# EAGLE board 2018-SPIT-IH-Ver4-Atmeha-final1 (EAGLE 6.1), part 1 of 3
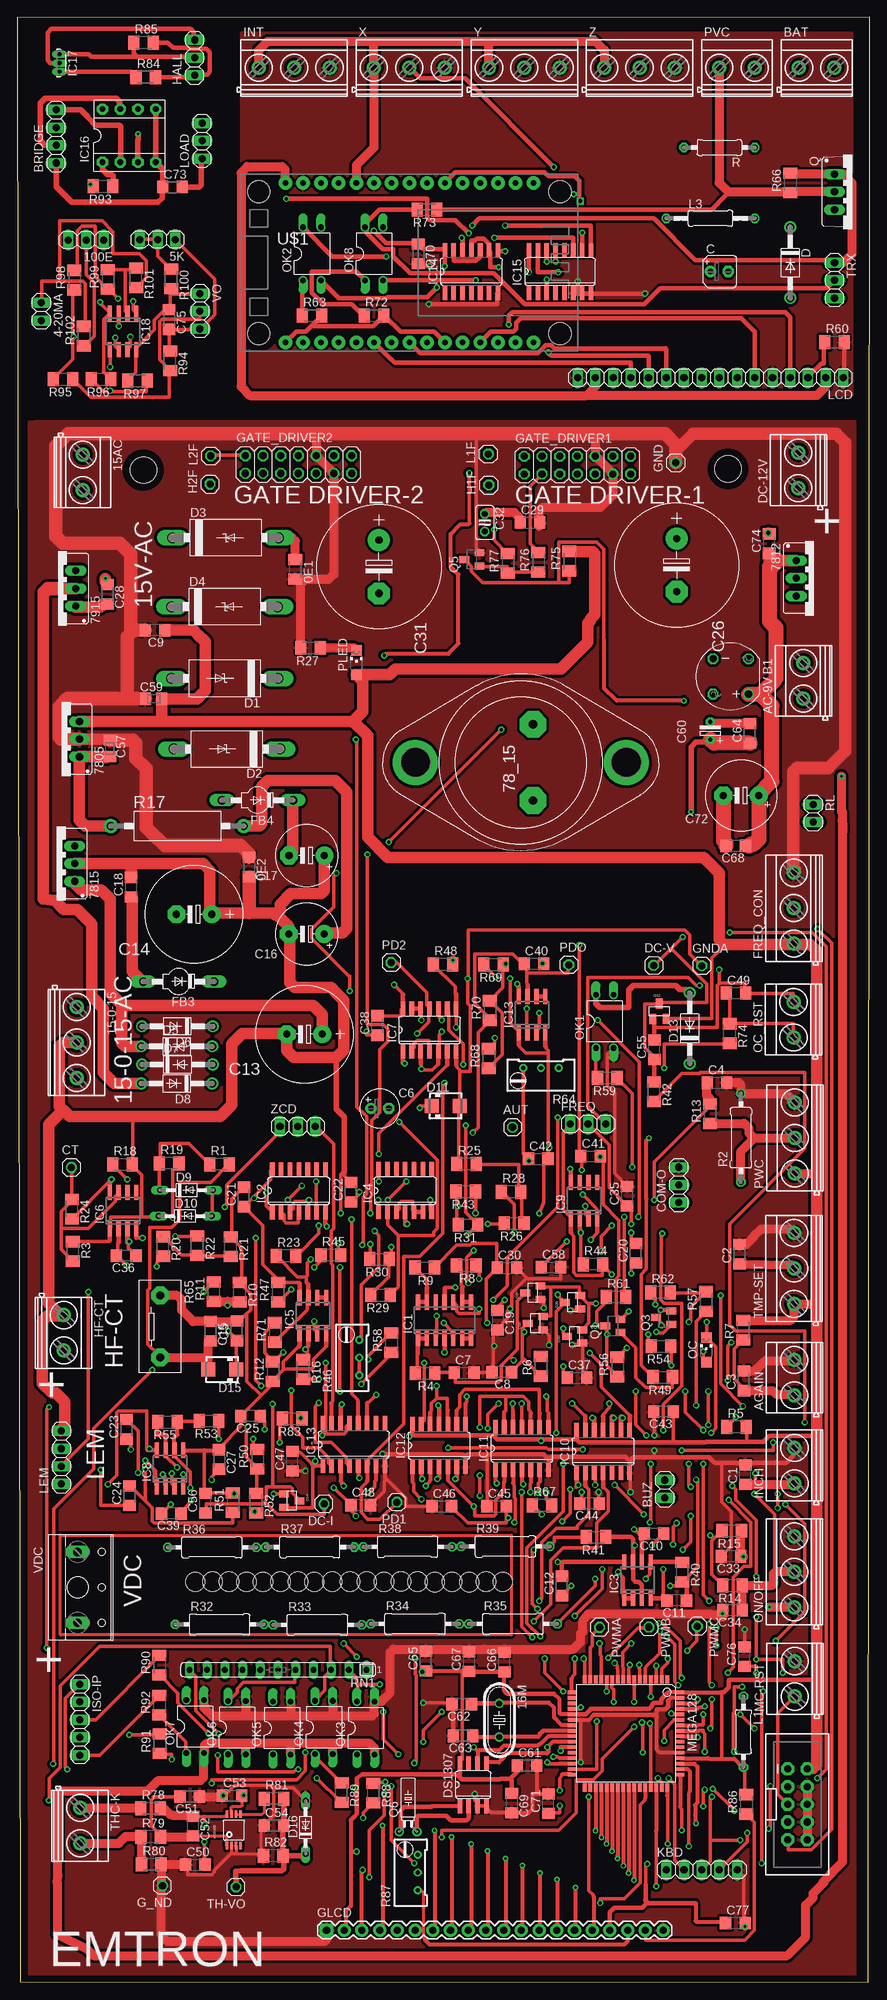
[diagram p4: board, top side]
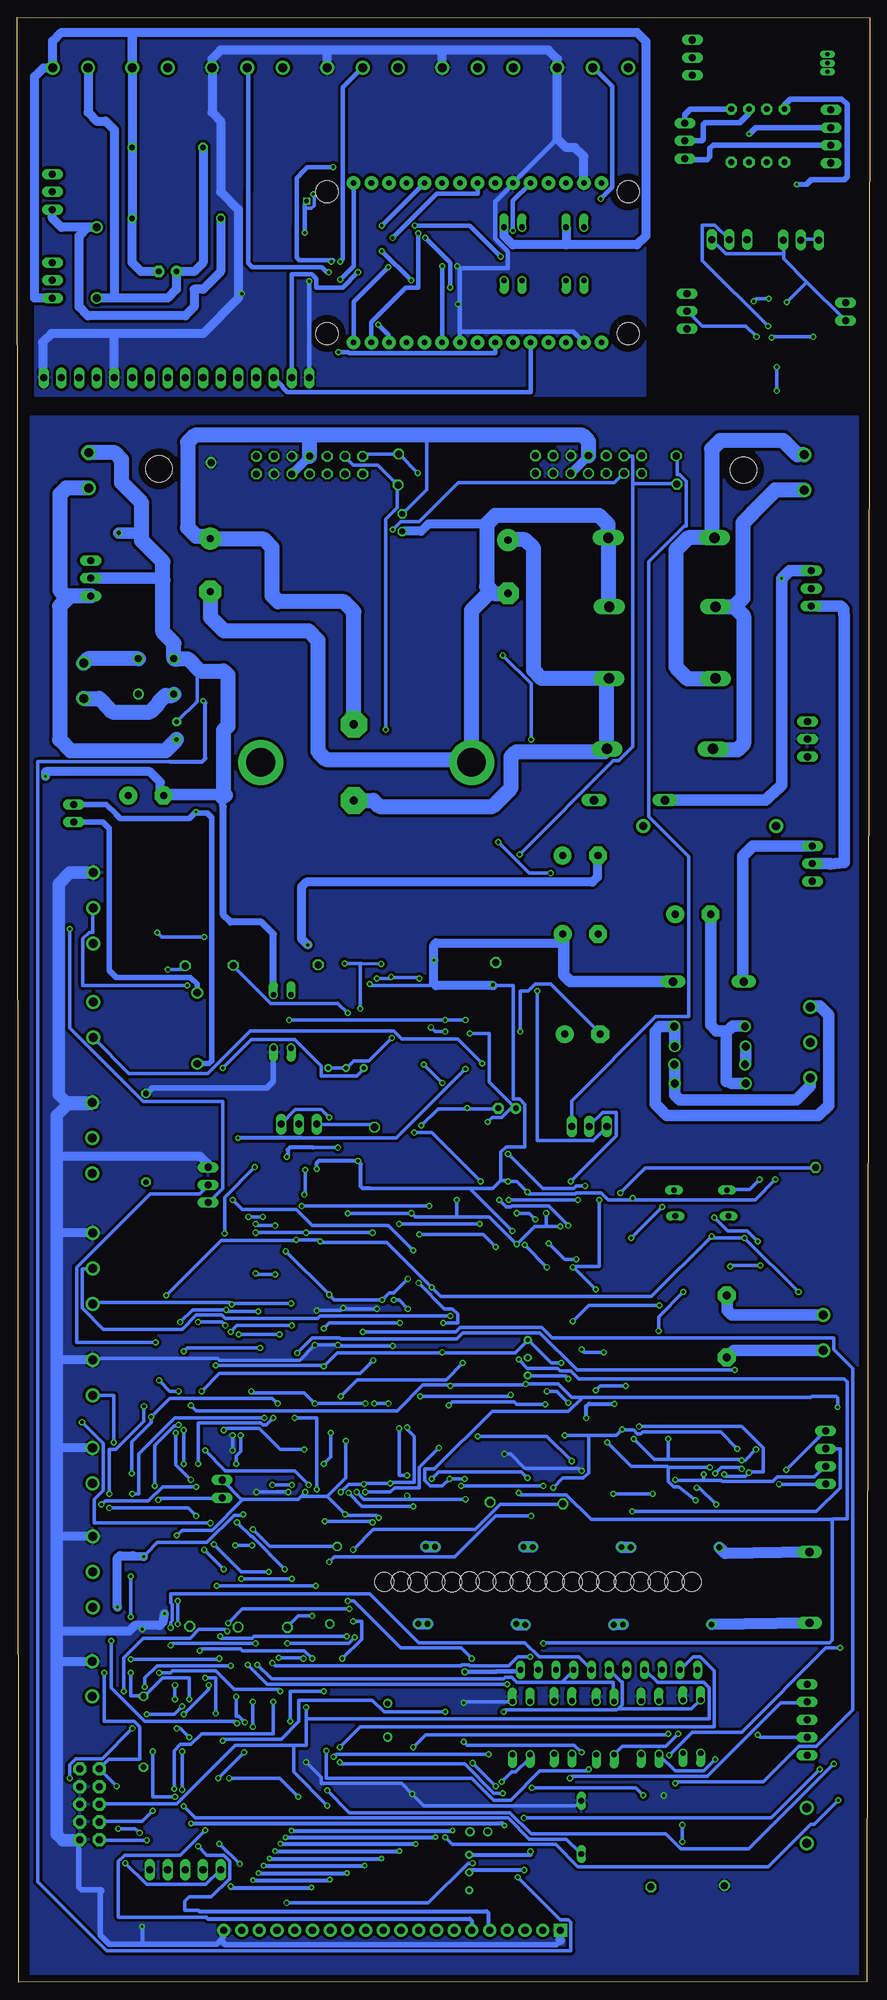
[diagram p5: board, bottom side, seen from below]

Size 122.19 x 281.79 mm. Coordinates in mm from the lower left corner, seen from the top.
Outline: 0.42,0.05 121.98,0 122.19,281.79 0,281.76 0.42,0.05
Copper layers (1*16): Top 0.035mm / dielectric 1.5mm / Bottom 0.035mm
Design rules: minimum track width 20mil, minimum drill 18mil, track to track 8mil, track to pad 8mil, pad to pad 8mil, via to via 8mil, smd to smd 8mil, copper to edge 40mil, drill to drill 8mil, minimum pad ring 10mil, minimum via ring 8mil, stop-mask expansion 4mil, vias tented up to drill 0mil, thermal gap 10mil
Holes 2.8 mm at 25.5,57.4 27.96,57.44 30.34,57.42 32.82,57.4 35.22,57.4 37.74,57.43 40.24,57.45 42.57,57.4 45.14,57.46 47.68,57.45 50.1,57.44 52.55,57.4 54.98,57.47 57.35,57.46 59.85,57.37 62.32,57.4 64.8,57.37 67.18,57.42 69.59,57.4
Holes 3.81 mm at 101.89,217.04 18.05,216.86

## Footprints (pad centres in the part's own frame; a part is rotated, then mirrored left to right if it is on the bottom)
M1206 = smd 1.6 x 2: 1 -1.4,0; 2 1.4,0
C1206 = smd 1.6 x 1.8: 1 -1.4,0; 2 1.4,0
1X02 = drill 1.016 long: 1 -1.27,0; 2 1.27,0
1X03 = drill 1.016 long: 1 -2.54,0; 2 0,0; 3 2.54,0
MKDSN1,5/3-5,08 = drill 1.3 pad 2: 1 -7.641,0.025; 2 -2.561,0.025; 3 2.519,0.025
MKDSN1,5/2-5,08 = drill 1.3 pad 2: 1 -2.561,0.025; 2 2.519,0.025
HC49/S = drill 0.813: 1 -2.413,0; 2 2.413,0
TO3-78 = drill 1.194 pad 3.81 octagon: 1 -1.778,-5.461; 2 -1.778,5.461 | drill 4.115 pad 6.477: 3 15.113,0; 3@ -15.113,0
78XXS = drill 1.016 long: GND 0,-2.54; IN -2.54,-2.54; OUT 2.54,-2.54
79XXS = drill 1.016 long: GND -2.54,-2.54; IN 0,-2.54; OUT 2.54,-2.54
MSOP8 = smd 0.4 x 1.1: 1 -0.975,-2.25; 2 -0.325,-2.25; 3 0.325,-2.25; 4 0.975,-2.25; 5 0.975,2.25; 6 0.325,2.25; 7 -0.325,2.25; 8 -0.975,2.25
1X01 = drill 1.016 octagon: 1 0,0
RB1A = drill 1.016: + -2.54,2.54 | drill 1.016 octagon: - 2.54,-2.54; AC1 2.54,2.54; AC2 -2.54,-2.54
1X04 = drill 1.016 long: 1 -3.81,0; 2 -1.27,0; 3 1.27,0; 4 3.81,0
B45181A = drill 0.813 pad 1.6: + -1.27,0 | drill 0.813 pad 1.6 octagon: - 1.27,0
E2,5-6 = drill 0.813 pad 1.6: + -1.27,0 | drill 0.813 pad 1.6 octagon: - 1.27,0
E5-13 = drill 1.016 pad 2.54: + -2.54,0 | drill 1.016 pad 2.54 octagon: - 2.54,0
E5-8,5 = drill 1.016 pad 2.54: + -2.54,0 | drill 1.016 pad 2.54 octagon: - 2.54,0
E7,5-18 = drill 1.016 pad 3.15: + -3.81,0 | drill 1.016 pad 3.15 octagon: - 3.81,0
C025-025X050 = drill 0.813 octagon: 1 -1.27,0; 2 1.27,0
R/2012-12R = smd 1.55 x 1.8: + 1.175,0; - -1.175,0
ES-2,5 = drill 0.61 pad 1.27 octagon: 1 -1.27,0; 2 1.27,0
E5-10,5 = drill 1.016 pad 2.54: + -2.54,0 | drill 1.016 pad 2.54 octagon: - 2.54,0
DO41-10 = drill 1.118: A 5.08,0; C -5.08,0
C4111-15 = drill 1.499 long: A 7.62,0; C -7.62,0
DO34Z7 = drill 0.813 long: A 3.81,0; C -3.81,0
SMA = smd 2 x 2: A 2,0; C -2,0
SOT23 = smd 1 x 1.4: 1 -0.95,-1.1; 2 0.95,-1.1; 3 0,1.1
SOIC-8 = smd 2.032 x 0.66: 1 -3.073,1.27; 2 -3.073,0; 3 -3.073,-1.27; 4 -3.073,-2.54; 5 3.073,-2.54; 6 3.073,-1.27; 7 3.073,0; 8 3.073,1.27
SOD57-10 = drill 1.194 long: A 5.08,0; C -5.08,0
2X07 = drill 1.016 octagon: 1 -7.62,-1.27; 2 -7.62,1.27; 3 -5.08,-1.27; 4 -5.08,1.27; 5 -2.54,-1.27; 6 -2.54,1.27; 7 0,-1.27; 8 0,1.27; 9 2.54,-1.27; 10 2.54,1.27; 11 5.08,-1.27; 12 5.08,1.27; 13 7.62,-1.27; 14 7.62,1.27
1X20 = drill 1.016 pad 1.88 square: 1 0,0 | drill 1.016 pad 1.88: 2 2.54,0; 3 5.08,0; 4 7.62,0; 5 10.16,0; 6 12.7,0; 7 15.24,0; 8 17.78,0; 9 20.32,0; 10 22.86,0; 11 25.4,0; 12 27.94,0; 13 30.48,0; 14 33.02,0; 15 35.56,0; 16 38.1,0; 17 40.64,0; 18 43.18,0; 19 45.72,0; 20 48.26,0
SO14 = smd 0.6 x 2.2: 1 -3.81,-2.6; 2 -2.54,-2.6; 3 -1.27,-2.6; 4 0,-2.6; 5 1.27,-2.6; 6 2.54,-2.6; 7 3.81,-2.6; 8 3.81,2.6; 9 2.54,2.6; 10 1.27,2.6; 11 0,2.6; 12 -1.27,2.6; 13 -2.54,2.6; 14 -3.81,2.6
SO14' = smd 0.66 x 2.032: 1 -3.81,-3.073; 2 -2.54,-3.073; 3 -1.27,-3.073; 4 0,-3.073; 5 1.27,-3.073; 6 2.54,-3.073; 7 3.81,-3.073; 8 3.81,3.073; 9 2.54,3.073; 10 1.27,3.073; 11 0,3.073; 12 -1.27,3.073; 13 -2.54,3.073; 14 -3.81,3.073
SO08 = smd 0.6 x 2.2: 1 -1.905,-2.6; 2 -0.635,-2.6; 3 0.635,-2.6; 4 1.905,-2.6; 5 1.905,2.6; 6 0.635,2.6; 7 -0.635,2.6; 8 -1.905,2.6
SO16 = smd 0.66 x 2.032: 1 -4.445,-3.073; 2 -3.175,-3.073; 3 -1.905,-3.073; 4 -0.635,-3.073; 5 0.635,-3.073; 6 1.905,-3.073; 7 3.175,-3.073; 8 4.445,-3.073; 9 4.445,3.073; 10 3.175,3.073; 11 1.905,3.073; 12 0.635,3.073; 13 -0.635,3.073; 14 -1.905,3.073; 15 -3.175,3.073; 16 -4.445,3.073
DIL08 = drill 0.813 pad 1.6 octagon: 1 -3.81,-3.81; 2 -1.27,-3.81; 3 1.27,-3.81; 4 3.81,-3.81; 5 3.81,3.81; 6 1.27,3.81; 7 -1.27,3.81; 8 -3.81,3.81
SIP3-UA = drill 0.6 pad 0.7 long: 1 -1.27,0; 2 0,0; 3 1.27,0
1X05 = drill 1.016 long: 1 -5.08,0; 2 -2.54,0; 3 0,0; 4 2.54,0; 5 5.08,0
2X5-SHROUDED_LOCK = drill 1.016 pad 1.88 octagon: 1 -1.397,5.08; 2 1.397,5.08; 3 -1.397,2.54; 4 1.397,2.54; 5 -1.397,0; 6 1.397,0; 7 -1.397,-2.54; 8 1.397,-2.54; 9 -1.397,-5.08; 10 1.397,-5.08
0207/10 = drill 0.813 octagon: 1 -5.08,0; 2 5.08,0
0207/12 = drill 0.813 octagon: 1 -6.35,0; 2 6.35,0
1X16 = drill 1.016 long: 1 -19.05,0; 2 -16.51,0; 3 -13.97,0; 4 -11.43,0; 5 -8.89,0; 6 -6.35,0; 7 -3.81,0; 8 -1.27,0; 9 1.27,0; 10 3.81,0; 11 6.35,0; 12 8.89,0; 13 11.43,0; 14 13.97,0; 15 16.51,0; 16 19.05,0
TQFP64 = smd 1.194 x 0.559: 1 -7.76,5.905; 2 -7.76,5.118; 3 -7.76,4.331; 4 -7.76,3.543; 5 -7.76,2.756; 6 -7.76,1.968; 7 -7.76,1.181; 8 -7.76,0.394; 9 -7.76,-0.394; 10 -7.76,-1.181; 11 -7.76,-1.968; 12 -7.76,-2.756; 13 -7.76,-3.543; 14 -7.76,-4.331; 15 -7.76,-5.118; 16 -7.76,-5.905; 33 7.76,-5.905; 34 7.76,-5.118; 35 7.76,-4.331; 36 7.76,-3.543; 37 7.76,-2.756; 38 7.76,-1.968; 39 7.76,-1.181; 40 7.76,-0.394; 41 7.76,0.394; 42 7.76,1.181; 43 7.76,1.968; 44 7.76,2.756; 45 7.76,3.543; 46 7.76,4.331; 47 7.76,5.118; 48 7.76,5.905 | smd 0.559 x 1.194: 17 -5.905,-7.76; 18 -5.118,-7.76; 19 -4.331,-7.76; 20 -3.543,-7.76; 21 -2.756,-7.76; 22 -1.968,-7.76; 23 -1.181,-7.76; 24 -0.394,-7.76; 25 0.394,-7.76; 26 1.181,-7.76; 27 1.968,-7.76; 28 2.756,-7.76; 29 3.543,-7.76; 30 4.331,-7.76; 31 5.118,-7.76; 32 5.905,-7.76; 49 5.905,7.76; 50 5.118,7.76; 51 4.331,7.76; 52 3.543,7.76; 53 2.756,7.76; 54 1.968,7.76; 55 1.181,7.76; 56 0.394,7.76; 57 -0.394,7.76; 58 -1.181,7.76; 59 -1.968,7.76; 60 -2.756,7.76; 61 -3.543,7.76; 62 -4.331,7.76; 63 -5.118,7.76; 64 -5.905,7.76
CHIPLED_1206 = smd 1.5 x 1.5: A 0,-1.75; C 0,1.75
DIL04 = drill 0.813 offset: 1 -1.27,-3.81; 2 1.27,-3.81; 3 1.27,3.81; 4 -1.27,3.81
TO220BV = drill 1.016 long: D 0,-2.54; G -2.54,-2.54; S 2.54,-2.54
SOT23-BEC = smd 1 x 1.4: B -0.95,-1.1; C 0,1.1; E 0.95,-1.1
TC26H = drill 0.813: 1 -1.27,0; 2 1.27,0
0309/12 = drill 0.813 octagon: 1 -6.35,0; 2 6.35,0
CA5050 = drill 1.2 pad 2: 1 -9.525,0; 2 9.525,0
RTRIM64W = drill 0.61: 1 1.27,-2.54; 2 1.27,0; 3 1.27,2.54
MPC71-5 = drill 1.118 pad 2.54 octagon: 1 -4.445,0; 2 4.445,0
SIL11 = drill 0.813 long: 1 -12.7,0; 2 -10.16,0; 3 -7.62,0; 4 -5.08,0; 5 -2.54,0; 6 0,0; 7 2.54,0; 8 5.08,0; 9 7.62,0; 10 10.16,0; 11 12.7,0
ESP12E_DEVKIT = drill 0.8 pad 1.93: 3V3@0 -11.43,-7.62; 3V3@1 11.43,5.08; 3V3@2 11.43,-17.78; AD0 -11.43,17.78; CLK -11.43,-2.54; CMD -11.43,2.54; D0 11.43,17.78; D1 11.43,15.24; D2 11.43,12.7; D3 11.43,10.16; D4 11.43,7.62; D5 11.43,0; D6 11.43,-2.54; D7 11.43,-5.08; D8 11.43,-7.62; EN -11.43,-10.16; GND@0 -11.43,-5.08; GND@1 -11.43,-15.24; GND@2 11.43,2.54; GND@3 11.43,-15.24; RST -11.43,-12.7; RSV@0 -11.43,15.24; RSV@1 -11.43,12.7; RX 11.43,-10.16; SD0 -11.43,0; SD1 -11.43,5.08; SD2 -11.43,7.62; SD3 -11.43,10.16; TX 11.43,-12.7; VIN -11.43,-17.78 | hole 3.2: -10.16,21.59; 10.16,21.59; 10.16,-21.59; -10.16,-21.59
W237-2N = drill 1.194 long: 1 -5.08,-0.635; 2 5.08,-0.635

## Placement (x,y rotation side)
0E1  0E  [M1206]  39.86,202.62 270 top
0E2  [C1206]  33.23,159.93 270 top
4-20MA  [1X02]  3.43,239.59 270 top
5K  5k  [1X03]  20.11,249.93 180 top
15-0-15  15-0-15  [MKDSN1,5/3-5,08]  8.49,132.19 270 top
15AC  [MKDSN1,5/2-5,08]  9.34,216.51 270 top
16M  16MHz  [HC49/S]  69.1,37.55 270 top
78_15  [TO3-78]  72.17,174.93 180 top
100E  [1X03]  9.84,249.86 180 top
7805  [78XXS]  6.36,178.28 90 top
7812  [78XXS]  114.21,201.35 270 top
7815  [78XXS]  5.65,160.43 90 top
7915  [79XXS]  5.82,199.89 90 top
AC-9V  [MKDSN1,5/2-5,08]  112.7,186.66 90 top
AD8495  AD849X  [MSOP8]  31.02,21.83 0 top
AGAIN  [MKDSN1,5/2-5,08]  111.43,86.72 90 top
AUT  [1X01]  70.99,122.62 0 top
B1  [RB1A]  102.3,187.27 180 top
BAT  [MKDSN1,5/2-5,08]  114.63,274.56 0 top
BRIDGE  [1X04]  5.55,264.73 90 top
BUZ  [1X02]  92.83,70.73 90 top
C  47uf  [B45181A]  100.66,245.35 0 top
C1  1u  [C1206]  104.4,72.8 90 top
C2  0.1  [C1206]  103.55,104.38 90 top
C3  1u  [C1206]  104.16,86.24 90 top
C4  0.1  [C1206]  100.33,129.01 0 top
C5  1u  [C1206]  31.46,93.41 90 top
C6  22uf  [E2,5-6]  51.98,125.31 0 top
C7  1uf  [C1206]  64.06,87.4 0 top
C8  1uf  [C1206]  69.45,87.51 180 top
C9  0.1  [C1206]  19.75,193.91 180 top
C10  0.01  [C1206]  91.29,64.3 180 top
C11  0.1  [C1206]  94.54,54.72 180 top
C12  0.1  [C1206]  78.06,56.84 90 top
C13  2000u  [E5-13]  41.17,135.96 180 top
C14  2000u  [E5-13]  25.33,153.15 180 top
C15  1n  [C1206]  27.66,93.34 270 top
C16  100u  [E5-8,5]  41.46,150.33 180 top
C17  100u  [E5-8,5]  41.48,161.57 180 top
C18  0.1  [C1206]  16.31,157.05 90 top
C19  1uf  [C1206]  68.86,94.93 270 top
C20  22nf  [C1206]  88.68,104.55 90 top
C21  0.1  [C1206]  32.49,112.62 90 top
C22  0.1  [C1206]  47.83,113.31 90 top
C23  0.1  [C1206]  15.66,79.28 90 top
C24  0.1  [C1206]  16.07,69.76 90 top
C25  0.1  [C1206]  33.42,81.18 180 top
C26  2000u  [E7,5-18]  94.53,203.24 270 top
C27  0.1  [C1206]  28.92,74.97 270 top
C28  0.1  [C1206]  12.9,199.04 270 top
C29  0.1  [C1206]  73.48,209.34 0 top
C30  1uf  [C1206]  70.2,102.45 0 top
C31  2000u  [E7,5-18]  51.84,203 270 top
C32  [C025-025X050]  67.01,209.33 270 top
C33  1u  [C1206]  102.34,61.06 180 top
C34  1u  [C1206]  102.53,53.34 180 top
C35  0.1  [C1206]  87.42,112.71 90 top
C36  100p  [C1206]  15.59,104.19 180 top
C37  0.1  [C1206]  80.24,86.69 0 top
C38  0.1  [C1206]  51.63,137.2 90 top
C39  0.1  [C1206]  22.05,67.22 180 top
C40  1n  [C1206]  74.06,146.06 0 top
C41  0.1  [C1206]  82.2,118.45 0 top
C42  0.1  [C1206]  74.68,118.07 0 top
C43  0.1  [C1206]  92.63,81.82 180 top
C44  0.1  [C1206]  82.04,68.64 180 top
C45  0.1  [C1206]  68.74,68.25 0 top
C46  0.1  [C1206]  60.85,68.24 0 top
C47  0.1  [C1206]  39.44,74.7 90 top
C48  0.1  [C1206]  49.23,68.42 0 top
C49  1nf  [C1206]  103.05,141.86 0 top
C50  0.01  [C1206]  25.5,16.85 0 top
C51  0.01  [C1206]  24.72,26.6 180 top
C52  0.1  [C1206]  25.16,22.37 270 top
C53  0.1  [C1206]  30.77,26.75 0 top
C54  1uF  [C1206]  36.8,22.47 0 top
C55  1uf  [C1206]  91.35,133.73 90 top
C56  1uf  [C1206]  26.96,68.67 90 top
C57  10u  [R/2012-12R]  13.25,176.94 270 top
C58  0.1  [C1206]  76.53,102.54 0 top
C59  10u  [R/2012-12R]  19.53,184.08 0 top
C60  100uf  [ES-2,5]  99.36,179.49 90 top
C61  1OU  [C1206]  73.09,31.07 0 top
C62  22pf  [C1206]  63.72,39.86 180 top
C63  22pf  [C1206]  63.89,35.32 180 top
C64  0.1  [C1206]  105.04,179.1 90 top
C65  0.1  [C1206]  58.56,46.06 90 top
C66  0.1  [C1206]  69.83,45.89 90 top
C67  0.1  [C1206]  64.76,45.98 90 top
C68  0.1  [C1206]  103.01,162.97 180 top
C69  0.1  [C1206]  70.88,25.67 270 top
C70  [C1206]  57.48,247.89 270 top
C71  0.1  [C1206]  76.15,25.59 90 top
C72  2000u  [E5-10,5]  103.76,170.18 180 top
C73  [C1206]  22.24,257.45 0 top
C74  0.1  [C1206]  107.81,206.32 90 top
C75  [C1206]  21.76,238.45 270 top
C76  0.1  [C1206]  104.23,46.69 90 top
C77  [C1206]  102.94,8.48 0 top
COM-O  [1X03]  94.84,114.34 90 top
CT  [1X01]  7.73,116.85 0 top
D  [DO41-10]  110.82,246.62 270 top
D1  [C4111-15]  29.72,186.99 180 top
D2  [C4111-15]  30.04,176.87 180 top
D3  [C4111-15]  29.85,207.16 0 top
D4  [C4111-15]  29.7,197.27 0 top
D5  1N4007  [DO41-10]  22.85,134.21 0 top
D6  1N4007  [DO41-10]  22.93,137.08 180 top
D7  1N4007  [DO41-10]  22.93,131.6 0 top
D8  1N4007  [DO41-10]  22.84,128.89 180 top
D9  15v  [DO34Z7]  24.24,113.6 0 top
D10  15v  [DO34Z7]  24.05,109.88 0 top
D11  1N4148  [SMA]  61.4,125.67 0 top
D12  BAV99  [SOT23]  92.05,139.25 0 top
D13  [DO41-10]  96.4,136.81 90 top
D14  BAV99  [SOT23]  39.33,69.04 270 top
D15  [SMA]  29.35,87.85 180 top
D16  BZV10  [DO34Z7]  41.33,22.18 90 top
D17  BAV99  [SOT23]  73.91,98.88 90 top
D18  BAV99  [SOT23]  74.26,94.5 90 top
D19  BAV99  [SOT23]  79.89,92.61 90 top
D20  BAV99  [SOT23]  79.6,97.51 90 top
DC-12V  [MKDSN1,5/2-5,08]  112.01,216.86 90 top
DC-I  [1X01]  43.98,68.58 180 top
DC-V  [1X01]  91.23,145.82 0 top
DS1307  DS1307  [SOIC-8]  64.7,28.32 90 top
FB3  [SOD57-10]  23.12,143.5 180 top
FB4  [SOD57-10]  34.41,169.51 180 top
FREQ  [1X03]  81.82,123.07 0 top
FREQ_CON  [MKDSN1,5/3-5,08]  111.33,156.6 90 top
G_ND  [1X01]  20.81,13.83 180 top
GATE_DRIVER1  [2X07]  80.3,217.58 0 top
GATE_DRIVER2  [2X07]  40.29,217.66 0 top
GLCD  LCD-G12864BARE  [1X20]  44.32,7.45 0 top
GND  [1X01]  94.4,217.93 90 top
GNDA  [1X01]  98.13,145.76 0 top
H1F  [1X01]  67.59,214.72 90 top
H2F  [1X01]  27.63,214.86 90 top
HALL  [1X03]  25.4,276.02 90 top
HF-CT  CT  [MKDSN1,5/2-5,08]  6.63,93.1 270 top
IC1  TL084D  [SO14]  61.24,94.93 0 top
IC2  4001D  [SO14']  40.35,113.5 0 top
IC3  TL082D  [SO08]  88.91,57.67 0 top
IC4  4093D  [SO14']  55.6,113.52 0 top
IC5  LM311D  [SO08]  42.36,95.57 0 top
IC6  LM311D  [SO08]  15.14,110.67 0 top
IC7  4093D  [SO14']  59.09,136.57 0 top
IC8  TL072D  [SO08]  21.88,73.67 0 top
IC9  TL082D  [SO08]  81.25,112.1 0 top
IC10  74HCT14D  [SO14']  83.98,76.11 0 top
IC11  74HCT74D  [SO14']  72.34,76.55 0 top
IC12  74HC08D  [SO14']  60.45,76.98 0 top
IC13  LM311D  [SO08]  73.78,138.76 0 top
IC14  74AC14D  [SO14']  65.1,245.35 0 top
IC15  4051D  [SO16]  77.8,245.35 0 top
IC16  INA114P  [DIL08]  16.01,264.84 0 top
IC17  A1301UA  [SIP3-UA]  6.04,275.25 90 top
IC18  LM358D  [SO08]  15.15,236.73 180 top
IC-13  4504D  [SO16]  48.23,77.1 0 top
INCH  [MKDSN1,5/2-5,08]  111.45,74.11 90 top
INT  [MKDSN1,5/3-5,08]  42.24,274.56 0 top
ISO-IP  [1X05]  8.95,37.63 270 top
ISP1  SPI  [2X5-SHROUDED_LOCK]  111.83,25.49 0 top
KBD  [1X05]  98.12,16.1 0 top
L1  1ou  [0207/10]  104.1,35.9 270 top
L1F  [1X01]  67.52,219.17 90 top
L2F  [1X01]  27.71,218.9 90 top
L3  [0207/12]  99.39,252.97 0 top
LCD  [1X16]  99.39,230.11 180 top
LEM  [1X04]  6.31,75.24 90 top
LOAD  [1X03]  26.47,264.09 90 top
MC-RST  [MKDSN1,5/2-5,08]  111.51,43.52 90 top
MEGA128  [TQFP64]  87.26,35.67 270 top
OC  [CHIPLED_1206]  98.78,90.66 0 top
OC_RST  [MKDSN1,5/2-5,08]  111.31,138.06 90 top
OK1  PC817  [DIL04]  84.21,137.79 0 top
OK2  PC817  [DIL04]  42.24,247.89 0 top
OK3  PC817  [DIL04]  49.95,36.44 0 top
OK4  PC817  [DIL04]  43.94,36.52 0 top
OK5  PC817  [DIL04]  37.91,36.42 0 top
OK6  PC817  [DIL04]  31.47,36.49 0 top
OK7  PC817  [DIL04]  25.48,36.64 0 top
OK8  PC817  [DIL04]  51.13,247.89 0 top
ON/OFF  [MKDSN1,5/3-5,08]  111.4,61.39 90 top
PD1  [1X01]  54.41,68.83 180 top
PD2  [1X01]  53.59,146.23 0 top
PDO  [1X01]  79.06,145.9 0 top
PLED  [CHIPLED_1206]  48.61,189.27 0 top
PVC  [MKDSN1,5/2-5,08]  103.2,274.56 0 top
PWC  [MKDSN1,5/3-5,08]  111.47,123.64 90 top
PWMA  [1X01]  83.48,50.88 270 top
PWMB  [1X01]  90.55,50.92 270 top
PWMC  [1X01]  97.48,51.02 270 top
Q  IRFZ44  [TO220BV]  119.71,256.78 270 top
Q1  2n2222  [SOT23-BEC]  85.39,94.11 90 top
Q3  2n2222  [SOT23-BEC]  92.66,95.3 90 top
Q5  2n2222  [SOT23-BEC]  65.16,204.06 90 top
Q6  32.767K  [TC26H]  56.02,21.57 0 top
R  [0207/10]  100.66,263.13 180 top
R1  10K  [M1206]  28.98,117.3 0 top
R2  [0309/12]  103.74,121.1 90 top
R3  10K  [M1206]  7.96,104.79 270 top
R4  100k  [M1206]  58.43,87.34 180 top
R5  10k  [M1206]  103.11,79.62 0 top
R6  100k  [M1206]  75.05,88.32 90 top
R7  10k  [M1206]  104.06,93.53 90 top
R8  100k  [M1206]  64.36,102.8 180 top
R9  100k  [M1206]  58.41,102.47 180 top
R10  15K  [M1206]  31.89,98.94 270 top
R11  10K  [M1206]  28.13,99.04 90 top
R12  4.7k  [M1206]  36.63,87.58 90 top
R13  2.2k  [M1206]  99.31,124.55 90 top
R14  10k  [M1206]  102.54,56.91 180 top
R15  10k  [M1206]  102.44,64.75 180 top
R16  4.7k  [M1206]  40.98,87.88 270 top
R17  100E/2W  [CA5050]  22.93,165.8 0 top
R18  10K  [M1206]  15.05,117.26 0 top
R19  1K  [M1206]  21.76,117.44 0 top
R20  1M  [M1206]  20.89,105.5 270 top
R21  1K  [M1206]  30.59,105.5 270 top
R22  1M  [M1206]  25.79,105.63 270 top
R23  0E  [M1206]  38.52,104.14 0 top
R24  1K  [M1206]  7.82,110.87 270 top
R25  4.7K  [M1206]  64.41,117.32 0 top
R26  10K  [M1206]  71.23,108.84 180 top
R27  2.2k  [M1206]  42.01,191.37 180 top
R28  47k  [M1206]  70.78,113.34 0 top
R29  10K  [M1206]  52.08,98.56 180 top
R30  10k  [M1206]  51.92,103.7 180 top
R31  4.7k  [M1206]  64.61,108.63 180 top
R32  1M/0.5W  [0309/12]  29,51.29 0 top
R33  [0309/12]  43.02,51.25 0 top
R34  [0309/12]  57.02,51.38 0 top
R35  [0309/12]  71.06,51.37 0 top
R36  [0309/12]  27.89,62.35 0 top
R37  [0309/12]  41.94,62.39 0 top
R38  [0309/12]  55.95,62.43 0 top
R39  [0309/12]  69.98,62.48 0 top
R40  15k  [M1206]  95.36,58.8 270 top
R41  15k  [M1206]  82.97,63.83 180 top
R42  100k  [M1206]  91.28,127.69 270 top
R43  1.5k  [M1206]  64.29,113.4 180 top
R44  100K  [M1206]  82.53,102.95 0 top
R45  0E  [M1206]  44.94,104.26 0 top
R46  10k  [RTRIM64W]  47.75,89.55 0 top
R47  1k  [M1206]  37.38,98.94 90 top
R48  2.2k  [M1206]  61.04,145.95 0 top
R49  22k  [M1206]  92.53,86.77 180 top
R50  36k  [M1206]  34.41,75.01 90 top
R51  36k  [M1206]  30.89,68.75 90 top
R52  36k  [M1206]  34.24,68.71 270 top
R53  36k  [M1206]  27.45,80.52 180 top
R54  2.2k  [M1206]  92.3,91.21 180 top
R55  36k  [M1206]  21.51,80.35 180 top
R56  2.2k  [M1206]  86.03,88.23 90 top
R57  0E  [M1206]  98.73,97.61 90 top
R58  0E {NC}  [M1206]  53.59,91.69 90 top
R59  100E  [M1206]  84.58,129.69 180 top
R60  [M1206]  117.17,235.19 0 top
R61  22k  [M1206]  85.84,98.24 0 top
R62  2.2k  [M1206]  92.2,98.92 0 top
R63  [M1206]  42.24,239 0 top
R64  10k  [RTRIM64W]  75.07,129.83 90 top
R65  15E/5W  [MPC71-5]  20.47,94.03 270 top
R66  [M1206]  110.82,258.05 90 top
R67  10K  [M1206]  75.23,68.38 0 top
R68  4.7k  [M1206]  67.58,132.47 90 top
R69  4.7k  [M1206]  68.27,145.95 180 top
R70  680K  [M1206]  67.75,139.35 90 top
R71  680K  [M1206]  36.92,93.19 90 top
R72  [M1206]  51.13,239 0 top
R73  [M1206]  58.75,254.24 180 top
R74  2.2k  [M1206]  102.15,136.05 270 top
R75  2.2k  [M1206]  79.16,203.81 90 top
R76  1K  [M1206]  74.71,203.64 90 top
R77  1K  [M1206]  70.33,203.49 90 top
R78  10k  [M1206]  19.1,24.89 0 top
R79  10k  [M1206]  19.12,20.84 0 top
R80  1M  [M1206]  19.19,16.87 0 top
R81  100k  [M1206]  36.81,26.31 0 top
R82  100k  [M1206]  36.68,18.11 0 top
R83  100k  [M1206]  39.4,80.83 180 top
R84  [M1206]  18.4,273.21 0 top
R85  [M1206]  18.08,278.16 0 top
R86  56E  [M1206]  104.52,25.5 90 top
R87  10k  [RTRIM64W]  56.14,15.71 0 top
R88  2.2K  [M1206]  51.04,27.11 270 top
R89  2.2K  [M1206]  46.48,27.18 270 top
R90  2.2K  [M1206]  20.36,45.45 90 top
R91  2.2K  [M1206]  20.4,34.2 90 top
R92  2.2K  [M1206]  20.35,39.75 90 top
R93  [M1206]  12.27,257.58 180 top
R94  1k  [M1206]  21.89,232.52 270 top
R95  10k  [M1206]  6.53,229.91 180 top
R96  10,5k  [M1206]  11.97,229.92 180 top
R97  25,5k  [M1206]  17.22,229.69 180 top
R98  10k  [M1206]  8.16,244.11 90 top
R99  100k  [M1206]  12.97,244.21 90 top
R100  10k  [M1206]  22.05,244.29 270 top
R101  100k  [M1206]  17.02,244.44 270 top
R102  240E  [M1206]  9.51,236.07 90 top
RL  [1X02]  114.11,167.64 270 top
RN1  10k  [SIL11]  37.36,44.78 180 top
TH-VO  [1X01]  31.35,13.64 180 top
THC-K  [MKDSN1,5/2-5,08]  8.98,22.42 270 top
TMP-SET  [MKDSN1,5/3-5,08]  111.39,104.93 90 top
TRX  [1X03]  117.17,244.08 270 top
U$1  ESP12E_DEVKIT  [ESP12E_DEVKIT]  56.21,246.62 270 top
VDC  [W237-2N]  9.26,56.61 270 top
VO  5k  [1X03]  26.17,239.66 270 top
X  [MKDSN1,5/3-5,08]  58.75,274.56 0 top
Y  [MKDSN1,5/3-5,08]  75.26,274.56 0 top
Z  [MKDSN1,5/3-5,08]  91.77,274.56 0 top
ZCD  [1X03]  40.19,122.73 0 top

## Tracks (layer width: path | path; a pad name or v marks a point on that pad's centre or on a via)
1-V_DC  (via drill 0.46)
  Top 0.508: 91.28,132.12 91.34,132.12 C55.1 91.21,132.76 89.94,134.03 89.94,140.25 91.97,140.25 D12.3 92.23,140.5 98.83,140.5 98.83,143.17 93.75,148.25 | v98.58,39.54 98.58,39.41 97.69,39.41 97.51,39.21 | v105.69,36.36 v103.66,38.4 | v114.71,29.25 115.98,30.52 115.98,148.51 113.94,150.54 v102.13,150.54 | 93.75,148.25 91.34,145.84 DC-V.1 | 93.75,148.25 v95.4,149.9 | v74.83,138.98 74.83,136.82 74.45,136.44 IC13.3
  Top 0.559: MEGA128.61 97.51,39.21
  Top 0.61: R42.1 91.28,132.12 91.28,132.47 91.26,132.49 91.27,132.49 91.29,132.5
  Bottom 0.508: v98.58,39.54 99.72,38.4 v103.66,38.4 | v105.69,36.36 110.01,32.05 113.82,32.05 114.71,31.16 v114.71,29.25 | v102.13,150.54 101.5,149.9 v95.4,149.9 | v74.83,138.98 76.23,140.38 85.88,140.38 91.21,145.71 DC-V.1
2  (via drill 0.46)
  Top 0.508: v24.95,69.1 23.52,67.23 C39.1 | v22.89,73.83 21.36,75.35 21.36,76.12 IC8.7 | v37.62,77.39 37.62,80.56 37.87,80.81 R83.2
  Top 0.559: IC8.7 21.25,78.26 21.04,78.46 20.19,78.46 20.07,78.57 20.07,80.31 R55.2
  Bottom 0.508: v24.95,69.1 27.33,71.04 28.09,71.04 28.85,71.8 28.85,73.83 | v22.89,73.83 28.85,73.83 | v37.62,77.39 34.19,73.96 28.98,73.96 28.85,73.83
2-I_DC  (via drill 0.46)
  Top 0.508: 36.6,71.04 35.71,71.04 35.71,69.13 35.46,68.88 | 36.6,71.04 39.14,71.04 39.4,70.78 39.4,70.15 40.41,69.13 D14.3 | 35.46,68.88 35.2,68.62 27.08,68.62 27.08,67.35 C56.1 | v40.62,80.89 40.28,81.45 40.79,80.94 R83.1 | 36.6,71.04 v36.58,82.91 | v93.75,38.52 93.75,38.4 94.77,38.4 MEGA128.60 | v95.28,43.6 95.02,43.86 95.02,48.94 92.48,51.48 v91.97,51.48 | v74.57,53.51 73.81,54.27 73.81,61.76 v74.07,62.02 | 35.46,68.88 37.24,67.1 43.97,67.1 43.97,68.5 DC-I.1
  Bottom 0.508: v93.75,38.52 93.75,43.6 v95.28,43.6 | v91.97,51.48 89.94,53.51 v74.57,53.51 | v74.07,62.02 71.15,64.94 56.54,64.94 52.98,68.5 44.09,68.5 DC-I.1
  Bottom 0.559: v40.62,80.89 40.62,82.57 40.23,82.96 36.72,82.96 36.6,82.83 36.6,82.89 v36.58,82.91
3-PWC  (via drill 0.46)
  Top 0.508: 72.42,89.45 72.42,89.07 70.89,87.55 C8.1 | 72.42,89.45 72.42,93.26 | 72.42,93.26 72.42,93.77 73.05,94.4 D18.3 | v92.74,34.59 92.74,36.11 94.13,37.51 94.13,37.63 94.77,37.63 MEGA128.59 | v60.86,38.78 58.19,36.11 v58.19,34.46 | v41.3,32.94 41.3,30.27 40.03,29 27.84,29 v27.84,28.49 | v72.67,93.26 72.42,93.26 | R6.1 74.96,87.04 72.54,89.45 72.42,89.45
  Bottom 0.508: v92.74,34.59 92.48,34.84 84.35,34.84 81.81,37.38 81.81,40.43 71.27,40.43 69.62,38.78 v60.86,38.78 | v58.19,34.46 57.68,33.95 42.32,33.95 v41.3,32.94 | v27.84,28.49 27.58,28.74 15.27,28.74 10.19,33.82 7.65,33.82 2.44,39.03 2.44,88.05 5.11,90.72 5.11,92.37 45.49,92.37 47.02,93.9 58.7,93.9 59.33,93.26 v72.67,93.26
3-PWC-I  (via drill 0.46)
  Top 0.508: C4.1 98.96,129.07 98.84,128.51 | v91.34,112.18 91.34,117.64 99.09,125.39 R13.2 | v65.43,104.94 64.41,103.93 64.41,100.5 v64.67,100.25 | v61.11,94.53 62.38,93.26 62.38,92.63 IC1.5
  Top 1.27: R13.2 99.31,126.72 98.84,127.19 98.84,128.51 98.99,128.66
  Bottom 0.508: v91.34,112.18 89.94,110.79 82.19,110.79 79.91,108.5 68.99,108.5 v65.43,104.94 | v64.67,100.25 60.99,96.56 59.84,96.56 59.08,95.8 59.08,94.53 v61.11,94.53
4-FREQ_CON  (via drill 0.46)
  Top 0.508: FREQ.2 81.94,122.98 84.86,120.06 84.86,113.96 87.4,111.42 C35.1 87.53,111.17 88.04,110.66 v88.04,108.75 | v77.5,98.59 77.5,98.47 78.38,97.58 D20.3 78.38,97.32 77.24,96.18 v77.24,78.78 | v69.88,97.83 68.86,96.82 68.86,96.44 C19.1 | v98.32,38.4 98.32,36.87 97.82,36.87 97.57,36.85 | v94.77,42.59 94.26,43.1 94.26,48.43 v93.12,49.57 | v74.96,49.57 73.05,51.48 73.05,62.27 78.26,67.48 v78.26,74.34 | v66.19,100.88 66.19,102.4 65.81,102.79 R8.1 | v85.24,108.5 83.72,106.98 v83.72,104.82
  Top 0.559: MEGA128.58 97.57,36.85 97.58,36.84
  Bottom 0.508: v98.32,38.4 94.77,41.95 v94.77,42.59 | v93.12,49.57 92.86,49.32 88.54,49.32 88.29,49.57 v74.96,49.57 | v78.26,74.34 77.24,75.35 v77.24,78.78 | v66.19,100.88 68.22,98.85 68.86,98.85 v69.88,97.83 76.73,97.83 v77.5,98.59 v83.72,104.82 | v88.04,108.75 87.78,108.5 v85.24,108.5
5-TH-VO  (via drill 0.46)
  Top 0.508: v98.58,33.06 98.58,35.6 98.32,35.86 98.32,36.11 97.94,36.11 97.73,36.06 | v98.58,27.6 98.32,27.35 v98.32,25.19 | 38.16,17.82 38.25,17.82 R82.2
  Top 0.559: MEGA128.57 97.73,36.06
  Top 0.813: TH-VO.1 31.34,15.92 32.09,15.97 37.93,15.97 38.16,16.21 38.16,17.82 38.16,17.95 38.11,18.01 | R81.2 C54.2 38.08,22.34 R82.2 41.07,18.11 D16.C
  Bottom 0.508: v98.58,27.6 v98.58,33.06 | v98.32,25.19 96.67,23.54 51.84,23.54 48.79,20.49 43.46,20.49 41.43,18.46 D16.C
6-TMP-SET  (via drill 0.46)
  Top 0.508: 70.64,89.7 69.37,88.43 69.37,86.4 68.99,86.02 62.76,86.02 62.76,87.29 C7.1 62.51,87.42 59.84,87.42 R4.1 | 70.64,89.7 71.65,90.72 71.65,97.71 72.8,98.85 D17.3 | v99.34,36.36 99.59,36.62 v99.59,40.56 | v99.59,42.59 99.21,42.97 v99.21,51.35 | v99.21,54.65 98.32,55.54 v98.32,74.34 | v98.32,79.16 95.78,81.7 v95.78,84.75 | 70.64,89.7 v71.15,89.2 | v97.56,35.09 97.56,35.28
  Top 0.559: MEGA128.56 97.56,35.28
  Bottom 0.508: v97.56,35.09 98.83,36.36 v99.34,36.36 | v99.59,42.59 v99.59,40.56 | v99.21,54.65 v99.21,51.35 | v98.32,79.16 v98.32,74.34 | v95.78,84.75 93.24,87.29 73.05,87.29 v71.15,89.2
6-TMP-SET-I  (via drill 0.46)
  Top 0.508: v60.1,95.55 60.1,92.63 IC1.3 | 110.92,102.88 111.28,102.4 TMP-SET.2
  Top 1.27: C2.1 110.92,102.88 111.4,102.4 111.4,102.51
  Bottom 0.508: v60.1,95.55 78.77,95.55 79.15,95.17 92.35,95.17 92.86,95.67 96.55,95.67 98.58,93.64 109.88,93.64 112.93,96.69 112.93,102.28 111.4,102.28 TMP-SET.2
15_GND
  Top 0.508: D3.A 37.49,207.18 37.45,207.22
  Top 1.27: 0E1.1 39.86,206.7 39.33,207.23 37.45,207.23 37.45,207.22 37.35,207.12
  Bottom 0.508: C32.2 67.08,208.07 66.89,208.08
  Bottom 1.27: 54.89,209.14 63.26,209.14 64.31,208.08 66.89,208.08 66.91,208.06
  Bottom 2.184: D4.A 37.47,197.42 D3.A 37.47,209.05 38.77,210.34 53.69,210.34 54.89,209.14 54.89,200.19 54.26,199.56 | 54.26,199.56 53.87,199.17 51.86,199.17 C31.- | 54.26,199.56 57.06,196.76 78_15.3 57.48,175.35 77.94,175.35 79.1,176.51 79.1,192.43 80.48,193.82 92.6,193.82 94.53,195.75 C26.-
+3V3N  (via drill 0.46)
  Top 0.61: 42.3,237.66 41.35,236.71 39.95,236.71 U$1.3V3@2 | 42.3,237.66 R63.2 | 42.3,237.66 42.49,237.47 51,237.47 R72.2 52.78,238.87 54.94,236.71 59.76,236.71 U$1.3V3@1 | 84.15,274.56 Z.1 | v61.29,246.11 IC14.14 61.29,248.52 58.24,248.52 C70.1 57.22,249.41 52.91,249.41 v51.13,251.19
  Top 1.27: INT.1 34.6,277.08 35.89,278.37 51.13,278.37 | 51.13,278.37 67.64,278.37 | 67.64,278.37 82.88,278.37 84.15,277.1 84.15,274.56 | 51.13,278.37 51.11,278.35 X.1 51.11,263.11 48.59,260.59 U$1.3V3@0 | Y.1 67.62,278.35 67.64,278.37
  Bottom 0.61: U$1.3V3@1 v61.29,246.11 | U$1.3V3@0 51.13,255.51 v51.13,251.19
+5V  (via drill 0.46, 0.5, 0.6)
  Top 0.406: AD8495.7 30.69,25.11 30.77,25.19 32.09,25.19 32.25,25.35 32.25,26.45 C53.2
  Top 0.508: 70.13,66.59 C45.2 | 70.13,66.59 70.13,65.83 64.54,65.83 62.26,68.11 C46.2 | 99.85,63.54 100.99,64.69 R15.2 | 99.85,63.54 99.59,63.29 99.59,58.46 101.12,56.94 R14.2 | v80.92,70.27 80.92,69 80.67,68.75 C44.2 | v75.21,67.1 73.94,68.37 R67.1 | v99.34,64.05 99.85,63.54 | v70.38,66.59 70.13,66.59 | v32.44,26.81 32.41,26.59 C53.2 | v48.41,27.86 48.68,27.86 | GLCD.2 46.89,7.41 46.97,7.39 | 81.94,97.2 81.94,94.53 81.05,93.64 D19.2 | 81.94,97.2 80.8,98.34 D20.2 80.54,98.59 80.54,99.74 76.48,99.74 | 76.48,99.74 75.08,99.74 D17.2 | 76.48,99.74 76.48,95.55 75.46,95.55 D18.2 | 42.32,74.08 42.32,67.99 38.25,67.99 D14.2 | 42.32,74.08 42.51,74.28 42.7,74.46 v42.7,74.72 | C47.2 39.52,75.99 40.54,75.99 42.19,74.34 42.19,74.21 42.32,74.08 | R86.2 104.42,26.97 104.29,27.09 104.29,30.65 L1.2 | 98.96,32.13 98.96,32.17 99.19,32.04 | C66.1 69.88,44.49 69.68,44.52 | 69.81,41.95 69.88,41.95 69.86,41.71 | D12.2 93.12,138.22 99.59,138.22 99.59,146.85 100.86,148.12 101.3,148.83 | 94.01,77.38 94.01,81.7 C43.1 | 104.55,77.44 104.55,79.54 R5.2 | v91.47,97.2 91.47,98.21 90.83,98.85 R62.1 | 113.82,43.36 113.82,43.35 114.6,43.35 | 111.37,96.69 111.4,96.69 TMP-SET.1 | 100.99,41.58 100.99,32.04 | v56.16,78.27 56.41,78.53 56.64,78.65 | v82.96,97.32 82.07,97.32 81.94,97.2 | 21.49,184.06 21.49,184.07 20.7,184.07 | 63.78,44.66 63.78,31.92 63.53,31.67 DS1307.8 | PLED.A 48.67,187.62 48.92,187.17 | v75.08,77.64 75.08,77.81 | 82.79,196.1 82.32,196 82.12,195.23
  Top 0.559: MEGA128.21 77.9,38.43 77.74,38.58 77.74,40.53 76.92,41.35 | 69.81,41.7 69.81,41.95 69.81,44.46 C66.1 | C65.1 63.78,44.66 64.68,44.66 C67.1 64.82,44.51 | MEGA128.52 98.96,32.13 99.01,32.13 | 101.29,41.58 100.99,41.58 MEGA128.64 93.35,41.58 93.11,41.34 | IC-13.1 42.76,74.03 42.51,74.28 42.48,74.3 | 68.53,78.09 68.53,78.26 68.41,78.38 | 80.17,77.93 80.05,77.81 80.15,77.81 | 56.64,78.65 56.82,78.46 56.86,78.46 | 98.66,77.38 98.73,77.44 | 107.41,77.91 107.41,77.92 | 114.41,78.34 114.6,78.53 | 99.19,32.04 100.99,32.04 102.77,32.04 103.97,30.83 104.09,30.83 L1.2 | 47.8,23.21 47.8,18.81 | 47.8,18.81 47.8,10.94 47.06,10.19 47.06,7.48 46.97,7.39 | v48.6,18.71 47.9,18.71 47.8,18.81
  Top 0.61: 101.29,41.58 101.98,42.27 101.98,43.27 102.07,43.36 113.82,43.36 113.91,43.36 114.01,43.46 | 114.36,33.19 114.6,32.96 | DS1307.8 63.43,29.35 | 63.43,29.35 63.72,29.07 69.18,29.07 69.26,29.15 70.66,29.15 | 70.66,29.15 70.88,28.93 C69.1 | C61.1 71.69,30.18 70.66,29.15 | 64.82,44.51 69.45,44.51 69.46,44.52 69.68,44.52 69.7,44.5 | 47.8,23.21 48.35,23.76 48.35,23.81 48.68,24.14 48.68,27.86 48.68,29.21 49.47,29.81 62.7,29.81 63.43,29.35 | IC11.14 68.53,78.26 | 68.53,78.09 68.82,77.81 75.08,77.81 80.05,77.81 | IC10.14 80.17,77.93 | IC12.14 56.64,78.65 | 56.86,78.46 56.93,78.38 68.41,78.38 | 80.15,77.81 80.58,77.38 94.01,77.38 98.66,77.38 | 98.73,77.44 104.55,77.44 106.94,77.44 107.41,77.91 | 107.41,77.92 107.84,78.34 114.41,78.34 | 76.92,41.35 70.22,41.35 69.86,41.71 | C65.1 58.18,44.66 v58.04,44.51 | MEGA128.21 81.5,38.43 82.15,39.08 82.15,39.09 82.27,39.21 90.57,39.21 91,39.63 91,39.82 91.26,40.08 92.31,40.08 92.32,40.1 92.32,40.55 93.11,41.34
  Top 1.27: PWC.1 114.34,116 114.41,115.92 114.6,115.92 | TMP-SET.1 113.91,97.29 114.6,96.6 | R7.2 110.86,94.92 111.37,95.43 111.37,96.69 111.37,97.17 111.47,97.27
  Top 1.676: 7805.OUT 20.75,180.82 | 20.75,180.82 48.15,180.82 | 48.15,180.82 50.21,178.76 50.21,164.22 53.11,161.31 98.39,161.31 100.6,159.1 100.6,149.53 101.3,148.83 111.42,148.83 | 111.42,148.83 FREQ_CON.1 | 111.42,148.83 113.72,148.83 114.6,147.95 114.6,115.92 114.6,96.6 114.6,78.53 114.6,43.35 114.6,32.96 114.6,31.09 114.13,30.63 113.28,30.63 ISP1.2 | 48.15,180.82 48.15,180.86 49.52,182.23 49.52,186.57 48.92,187.17 | PLED.A 53.39,187.52 54.2,188.33 77.9,188.33 81.79,192.22 81.79,194.89 82.12,195.23 | 82.23,195.54 82.79,196.1 82.79,204.9 82.51,205.18 79.19,205.18 R75.2 | C9.1 25.28,193.91 25.81,193.37 25.81,193.36 26.94,192.24 26.94,185.25 25.75,184.06 21.49,184.06 20.73,184.06 20.65,183.98 | C59.+ 20.7,184.07 20.7,181.49 20.73,181.46 20.73,180.84 20.75,180.82
  Bottom 0.508: 81.43,69.77 81.94,69.26 89.94,69.26 | 81.43,69.77 v80.92,70.27 | 89.94,69.26 90.07,69.26 92.74,71.92 BUZ.2 | 77.75,69.64 v75.21,67.1 75.08,66.97 70.76,66.97 v70.38,66.59 | 77.75,69.64 81.31,69.64 81.43,69.77 | v99.34,64.05 98.58,64.81 94.26,64.81 89.94,69.13 89.94,69.26 | TMP-SET.1 111.28,97.32 111.15,97.45 91.72,97.45 v91.47,97.2 91.34,97.32 v82.96,97.32 | v42.7,74.72 46.25,78.27 v56.16,78.27 | 77.75,69.64 75.08,72.31 v75.08,77.64 | v48.41,27.86 33.55,27.86 32.54,26.84 v32.44,26.81
  Bottom 0.559: R87.3 48.6,18.25 v48.6,18.71
  Bottom 0.61: v58.04,44.51 53.54,44.51 53.5,44.55 50.28,44.55 RN1.1
+5VN  (via drill 0.46)
  Top 0.61: v73.35,245.22 IC15.16
  Top 1.27: 81.61,227.57 33.35,227.57 32.08,228.84 32.08,259.5 32.95,260.38 37.95,260.38 38.34,259.99 38.34,258.14 U$1.VIN | 81.61,227.57 82.88,228.84 LCD.15 | LCD.2 115.9,228.84 114.63,227.57 81.61,227.57
  Bottom 0.61: v73.35,245.22 75.51,243.06 79.32,243.06 79.32,244.33 79.96,244.97 82.88,244.97 LCD.15
+12V  (via drill 0.38)
  Top 0.508: C60.1 99.47,178.22 99.26,178.35
  Top 0.813: v96.59,167.83 96.59,177.15 97.28,177.84 98.75,177.84 99.26,178.35
  Top 2.184: C64.1 99.89,177.69 C60.1
  Bottom 0.508: 115.99,199.54 115.98,199.56 115.36,198.81
  Bottom 0.813: RL.1 109.44,168.91 108.04,167.51 108.04,167.48 107.45,166.89 97.54,166.89 v96.59,167.83 96.58,167.82 96.58,167.81 96.41,167.64 94.94,167.64 94.34,167.04 94.34,132.12 94.74,131.73 D13.C
  Bottom 2.184: DC-12V.1 115.21,214.3 115.86,213.65 116.09,213.43 116.09,199.63 115.99,199.54 115.75,199.3 | 115.84,199.29 115.36,198.81 7812.OUT 114.68,198.81 116.14,197.35 116.14,178.18 114.6,176.63 100.95,176.63 C60.1
+12VN
  Top 0.61: 101.93,256.78 101.55,256.27 101.46,256.18 101.46,256.14 99.56,254.24 R73.1 | 111.33,256.78 R66.1
  Top 1.27: Q.D 111.33,256.78 110.82,256.78 | PVC.1 100.64,258.07 101.93,256.78 110.69,256.78 R66.1
+15V  (via drill 0.38, 0.46)
  Top 0.508: v78.26,88.31 78.26,87.29 78.77,86.78 C37.1 | v93.75,88.43 93.75,91.1 R54.1 | v61.24,90.34 61.28,90.48 | v35.46,79.29 35.46,80.43 34.84,81.07 C25.1 | IC-13.16 43.71,80.05 v43.71,78.4 43.84,78.66 44.22,78.66 | v45.36,70.91 47.78,68.5 C48.1 47.9,68.24 47.9,67.48 v48.54,66.84 | 44.22,78.66 46.89,78.66 47.14,78.91 47.14,79.67 47.52,80.05 IC-13.13 | 18.95,76.27 v18.95,76.5 18.57,76.5 18.57,81.96 14.5,81.96 14.25,81.7 14.25,72.69 v12.98,71.42 | v77.5,60.24 77.88,60.24 78.07,60.06 | 44.22,78.66 v44.22,88.82 | R64.3 72.54,130.98 72.54,118.79 73.18,118.15 C42.1 73.43,117.9 73.43,117.64 v73.35,117.77 | v92.74,131.11 92.74,134.54 102.13,134.54 R74.2 | v79.27,116.63 79.34,116.5 | C38.2 51.71,138.6 55.02,138.6 55.02,139.49 IC7.14 | v54,143.04 55.14,141.9 55.28,141.64 | 62.38,145.97 R48.2 | v71.65,143.17 71.65,143.04 71.86,142.83 | 40.4,100.27 40.16,100.37 37.49,100.37 R47.2 37.49,100.63 35.2,102.91 35.2,108.5 32.66,111.04 C21.1 32.54,111.29 33.81,112.56 | 33.81,112.56 36.35,115.1 36.35,116.37 IC2.14 | R24.2 7.9,109.52 12.98,114.6 13.23,114.6 | v49.05,113.33 49.05,113.07 47.9,111.93 C22.1 | v51.84,114.85 51.84,116.5 IC4.14 | v13.49,115.1 13.23,115.04 | v33.93,112.44 33.81,112.56 | v51.21,107.74 51.84,107.1 51.84,102.53 49.3,99.99 49.3,92.37 49.05,92.12 R46.3
  Top 0.559: IC8.8 18.95,76.27 18.69,76.27 18.67,76.29
  Top 0.61: IC5.8 40.45,100.22 40.4,100.27 | IC3.8 78.28,60.27 78.07,60.06 C12.2 | IC7.14 55.28,141.64 55.3,141.66 | IC13.8 71.88,142.81 71.86,142.83 | IC9.8 79.34,116.5 79.35,116.51 | IC6.8 13.23,114.6 13.23,115.04 13.26,115.07 | IC1.4 61.24,90.51 61.28,90.48
  Top 1.27: 62.38,145.97 62.38,146.49 v62.46,146.58
  Top 1.676: R17.2 34.69,165.8 35.03,166.14 35.03,171.48 35.9,172.35 45.58,172.35 47.25,170.68 47.25,151.12 46.58,150.45 43.77,150.45 43.58,150.26 43.92,150.26 C16.+
  Bottom 0.508: 61.24,90.21 50.83,90.21 49.05,91.99 R46.3 48.79,91.99 45.62,88.82 v44.22,88.82 | 61.24,90.21 76.35,90.21 v78.26,88.31 78.38,88.43 v93.75,88.43 | v61.24,90.34 61.24,90.21 | v43.71,78.4 40.28,78.4 | 40.28,78.4 36.35,78.4 v35.46,79.29 35.33,79.16 33.81,79.16 33.3,78.66 32.79,78.66 32.54,78.91 21.36,78.91 v18.95,76.5 | v45.36,70.91 43.97,72.31 41.05,72.31 40.28,73.07 40.28,78.4 | v12.98,71.42 6.38,71.42 LEM.1 | v77.5,60.24 76.73,61 59.46,61 53.62,66.84 v48.54,66.84 | v92.74,131.11 88.67,135.17 82.45,135.17 78.64,131.36 78.64,129.96 73.56,129.96 72.54,130.98 R64.3 | v71.65,143.17 71.4,142.92 63.02,142.92 62.47,143.24 | v54,143.04 54,142.92 51.08,142.92 51.08,126.66 50.19,126.66 49.43,125.9 49.43,119.8 52.1,119.8 52.86,119.04 52.86,114.98 | v13.49,115.1 16.41,112.18 33.93,112.18 | 33.93,112.18 37.49,112.18 38.51,113.2 42.06,113.2 42.19,113.07 48.79,113.07 v49.05,113.33 50.57,114.85 v51.84,114.85 51.97,114.98 52.86,114.98 | v33.93,112.44 33.93,112.18 | 57.18,113.83 54,113.83 52.86,114.98 | 57.18,113.83 71.65,113.83 | v51.21,107.74 57.18,113.71 57.18,113.83 | v79.27,116.63 79.34,116.79 | 73.31,117.64 73.3,117.64 v73.35,117.77
  Bottom 0.559: 71.65,113.83 72.71,113.83 72.94,114.07 72.94,117.27 73.31,117.64 73.42,117.75 73.43,117.75 73.46,117.77 78.95,117.77 79.34,117.39 79.34,116.79 79.26,116.71
  Bottom 1.27: 43.86,148.98 43.94,149.05 62.15,149.05 62.46,148.74 v62.46,146.58 v62.47,146.57 62.47,143.24 62.15,142.92 54,142.92
  Bottom 1.676: FB3.C 42.94,143.5 43.86,144.42 43.86,148.98 43.86,150.2 C16.+
-15V  (via drill 0.46)
  Top 0.508: v27.84,72.05 27.84,72.43 28.85,73.45 C27.2 | v23.77,72.81 23.77,71.29 IC8.4 | v22.63,106.98 25.68,106.98 R22.1 | 17.04,106.72 v17.93,106.72 | v78.77,106.21 75.21,102.66 C58.1 | v82.19,106.47 83.08,107.36 83.15,107.61 | v80.92,116.5 80.92,118.41 C41.1 80.54,118.41 v80.54,148.76 | v81.05,112.95 83.08,110.91 83.08,109.77 IC9.4 | v62.76,99.61 61.49,99.61 61.24,99.54 | v92.61,59.22 92.61,55.29 C11.2 | v95.4,62.02 96.55,63.16 v96.55,66.84 | v108.99,70.02 v108.99,67.99 | v104.04,82.59 100.86,85.77 v100.86,98.47 | v10.19,98.98 10.19,77.89 6.38,74.08 LEM.2
  Top 0.61: IC3.4 92.8,55.07 C11.2 | IC9.4 83.15,107.62 83.15,107.61 | IC6.4 17.04,106.72 | IC1.11 61.24,99.54 61.24,99.55
  Top 1.676: FB4.C 39.49,162.12 C17.-
  Bottom 0.508: v27.84,72.05 27.71,71.92 23.77,71.92 | 23.77,71.92 21.23,71.92 21.11,71.8 13.87,71.8 13.23,72.43 7.9,72.43 6.38,73.96 LEM.2 | 23.77,71.92 v23.77,72.81 | v80.92,116.5 80.92,112.95 v81.05,112.95 | v95.4,62.02 v92.61,59.22 | v96.55,66.84 97.69,67.99 v108.99,67.99 | v108.99,70.02 108.99,76.37 108.1,76.37 104.04,80.43 v104.04,82.59 | v100.86,98.47 92.99,106.34 82.32,106.34 v82.19,106.47 79.02,106.47 v78.77,106.21 78.64,106.09 69.24,106.09 v62.76,99.61 61.49,98.34 31.27,98.34 v22.63,106.98 22.38,106.72 v17.93,106.72 v10.19,98.98 | 39.01,161.46 C17.-
  Bottom 1.27: 39.01,161.46 39.01,158.49 39.74,157.77 80.76,157.77 81.49,157.04 81.49,149.7 v80.54,148.76
AD0  (via drill 0.46)
  Top 0.61: v75.89,244.21 IC15.3
  Bottom 0.61: v75.89,244.21 73.99,246.11 U$1.AD0
AGN-I  (via drill 0.46)
  Top 0.508: R7.1 104.04,92.12 102.77,90.85 102.77,86.53 103.91,85.39 C3.1 | v95.28,76.24 108.36,76.24 v108.36,77.39 | v80.42,71.29 80.17,71.29
  Top 0.61: IC10.1 80.17,71.29 80.17,71.07 80.15,71.05
  Top 1.27: C3.1 108.3,84.83 108.83,84.3 111.27,84.3 AGAIN.1
  Bottom 0.508: v80.42,71.29 82.45,73.32 92.35,73.32 v95.28,76.24 | v108.36,77.39 108.36,84.12 111.4,84.12 AGAIN.1
AGN-O  (via drill 0.46)
  Top 0.508: v83.59,11.35 83.59,11.98 87.02,11.98 89.31,14.27 89.31,25.44 89.94,26.08 90.01,26.35 | v56.92,17.06 53.62,20.36 v53.62,28.11 | v56.92,31.41 57.18,31.67 57.18,43.98 57.05,44.11 v57.05,46.4 | v74.83,54.65 75.21,55.03 75.21,63.03 77.24,65.07 80.29,65.07 80.29,65.45 81.94,67.1 81.94,70.65 81.69,70.91 81.49,71.13
  Top 0.559: MEGA128.44 90.01,26.35
  Top 0.61: IC10.2 81.44,71.19 81.49,71.13
  Bottom 0.508: v83.59,11.35 63.27,11.35 57.56,17.06 v56.92,17.06 | v56.92,31.41 v53.62,28.11 | v57.05,46.4 58.57,47.92 67.21,47.92 73.94,54.65 v74.83,54.65
BAT
  Bottom 1.27: BAT.1 112.07,268.19 110.82,266.94 109.55,266.94 108.28,265.67 108.28,241.54 | R.2 95.58,246.62 96.85,245.35 C.+ 99.39,242.81 100.66,241.54 108.28,241.54 | 108.28,241.54 D.A
BUZZER  (via drill 0.46)
  Top 0.508: v84.48,41.7 84.48,43.22 MEGA128.12 | v101.88,44.37 102.64,45.13 102.64,58.08 104.17,59.61 105.18,59.61 105.18,65.96 v102.01,69.13
  Bottom 0.508: v84.48,41.7 84.73,41.95 91.08,41.95 93.75,44.62 99.97,44.62 100.23,44.37 v101.88,44.37 | v102.01,69.13 101.75,69.38 92.86,69.38 BUZ.1
COMP_OP  (via drill 0.46)
  Top 0.508: CT.1 7.77,116.76 7.77,112.31 R24.1 7.77,112.06 6.25,110.53 6.25,108.12 | 6.25,108.12 6.25,105.07 7.9,103.42 R3.2 | v35.71,113.2 35.71,111.29 36.35,110.66 IC2.1 | 6.25,108.12 10.19,108.12 14,111.93 14,112.69 14.38,113.07 IC6.7
  Bottom 0.508: v35.71,113.2 32.16,116.76 7.77,116.76 CT.1
CS1  (via drill 0.38 pad 0.41, 0.46)
  Top 0.508: v91.59,13.76 91.59,21.51 91.56,21.7 | 79.98,7.34 79.91,7.41 GLCD.15
  Top 0.559: v80,13.57 80,7.43 79.97,7.39 80.03,7.39 79.98,7.34 79.97,7.33 | MEGA128.46 91.59,21.72 91.56,21.7
  Bottom 0.508: v91.59,13.76 91.59,13.51
  Bottom 0.559: 91.61,13.51 91.59,13.51 80.06,13.51 v80,13.57
CS2  (via drill 0.46)
  Top 0.508: 82.44,7.65 82.45,7.66 GLCD.16 | v81.94,26.59 81.94,13.12 82.58,12.49 82.64,12.28 | v91.85,29.25 92.35,28.74 92.35,28.11 MEGA128.47
  Top 0.559: 82.33,7.76 82.44,7.65 82.52,7.57 | 82.64,12.28 82.64,7.67 GLCD.16
  Bottom 0.508: v81.94,26.59 84.61,29.25 v91.85,29.25
D0  (via drill 0.46)
  Top 0.61: IC14.11 65.1,249.79 65.61,249.79 65.86,250.05 66.88,250.05 67.64,249.29 IC14.9 67.76,248.14 67.76,245.98 v69.03,245.98
  Bottom 0.61: v69.03,245.98 73.99,241.03 U$1.D0
D0-INV
  Top 0.61: R73.2 51.89,254.24 49.86,252.21 OK8.4 49.98,251.44 49.98,250.94 52.4,248.52 53.92,248.52 53.92,247.51 56.33,245.09 68.27,245.09 72.72,240.65 89.86,240.65 92.15,242.94 116.02,242.94 TRX.2
D0-OUT  (via drill 0.46)
  Top 0.61: OK2.4 45.16,247.51 v52.91,247.51 | v65.22,251.95 66.24,252.97 91.26,252.97 97.23,247 116.66,247 TRX.1
  Top 1.27: R66.2 110.95,259.32 Q.G 118.44,259.32 119.71,258.05 119.71,247.89 118.44,246.62 TRX.1
  Bottom 0.61: v52.91,247.51 57.35,251.95 v65.22,251.95
D1  (via drill 0.46)
  Top 0.61: v64.72,250.81 62.81,252.71 59.13,252.71 58.75,253.1 58.75,255.76 v38.55,255.76
  Bottom 0.61: U$1.D1 71.45,238.11 66.49,243.06 64.72,243.06 v64.72,250.81 | v38.55,255.76 36.9,257.41 36.9,271.89 39.57,274.56 INT.2
D2  (via drill 0.46)
  Top 0.61: LCD.4 110.82,237.73 110.85,237.76 110.85,238.8 110.11,239.54 70.99,239.54 70.43,238.99 v70.43,237.73
  Bottom 0.61: v70.43,237.73 68.91,236.2 U$1.D2
D3
  Top 0.61: LCD.6 105.74,236.71 103.78,238.67 72.19,238.67 71.54,238.02 71.54,237.13 71.12,236.71 67.89,236.71 U$1.D3
D5
  Top 0.508: 93,234.1 92.99,234.1 92.89,234.29
  Top 0.61: 93,234.35 93,234.1 LCD.11 | U$1.D5 57.73,233.66 74.62,233.66 75.77,234.81 76.57,234.81 77.08,234.29 92.89,234.29 92.97,234.3
D6  (via drill 0.46)
  Top 0.508: 90.5,232.96 90.45,232.96 90.42,233.26
  Top 0.61: 90.5,233.22 90.5,232.96 LCD.12 | v76.15,233.79 76.15,233.63 76.52,233.26 90.42,233.26 90.44,233.28
  Bottom 0.61: v76.15,233.79 74.75,233.79 74.62,233.66 53.67,233.66 U$1.D6
D7
  Top 0.61: LCD.13 87.96,232.25 87.94,232.15 87.81,232.3 54.09,232.3 53.61,232.78 53.54,232.78 U$1.D7
D8
  Bottom 0.61: LCD.14 84.15,228.84 84.15,228.71 83.51,228.08 48.59,228.08 U$1.D8
E  (via drill 0.46)
  Top 0.508: v95.28,21.76 95.28,24.81 95.15,24.93 95,25.15
  Top 0.559: MEGA128.49 95.02,25.16 95,25.15
  Bottom 0.508: v95.28,21.76 98.83,18.2 106.83,18.2 107.72,17.31 107.72,9.31 95.02,9.31 94.91,9.11
  Bottom 0.559: 94.91,9.11 57.36,9.11 57.01,8.76 57.01,7.46 GLCD.6
ERROR  (via drill 0.38, 0.46)
  Top 0.508: 77.62,200.7 79.15,200.7 79.15,202.35 R75.1 | 77.62,200.7 66.7,200.7 65.05,202.35 65.05,203.12 64.16,204 Q5.C | v75.97,31.54 75.97,31.28 77.5,31.28 77.7,31.34 | v52.6,27.09 52.6,23.92 50.44,21.76 v50.44,15.03 | 84.1,192.57 84.1,205.53 83.08,206.54 77.62,206.54 77.62,200.7
  Top 0.559: MEGA128.30 77.7,31.34 | v95.55,183.77 85.94,183.77 84.1,185.61 84.1,192.57
  Bottom 0.508: v75.97,31.54 75.72,31.28 58.06,31.28 53.87,27.09 v52.6,27.09 | v50.44,15.03 44.35,8.93 43.21,8.93 42.82,8.55 42.82,4.49 109.37,4.49 119.28,14.39 119.28,175.05 100.23,175.05
  Bottom 0.559: 100.23,175.05 95.7,175.05 95.22,175.52 95.22,183.45 v95.55,183.77
FRE  (via drill 0.46)
  Top 0.508: v66.19,96.56 66.19,95.93 63.27,95.93 63.02,96.18 63.02,97.07 62.64,97.45 IC1.10 | v68.22,97.83 70.26,99.86 70.26,103.93 77.5,111.17 v77.5,123.99 | v97.82,142.92 97.31,142.92 96.16,144.06 81.81,144.06 81.81,125.65 84.35,123.11 FREQ.3
  Bottom 0.508: v66.19,96.56 67.46,97.83 v68.22,97.83 | v77.5,123.99 78.64,125.14 82.32,125.14 84.35,123.11 FREQ.3 | v97.82,142.92 112.8,142.92 112.8,149.65 111.91,150.54 111.4,150.54 111.4,153.97 FREQ_CON.2
GNDA  (via drill 0.46)
  Top 0.508: v79.4,56.81 78.13,55.54 C12.1 | v93.62,56.81 95.15,56.81 95.15,57.19 R40.2 95.53,57.57 97.56,59.61 97.56,71.8 v97.31,72.05 | v92.23,96.44 92.23,96.31 93.75,96.31 Q3.E | v87.66,96.18 86.64,95.17 Q1.E 86.39,95.17 85.88,95.67 85.88,100.88 86.26,101.26 86.26,109.26 83.97,111.55 83.97,118.15 83.72,118.41 C41.2 83.59,118.41 v83.57,118.37 | v98.83,94.66 98.83,92.5 OC.C 98.96,92.24 100.1,91.1 100.1,79.42 v99.47,78.78 | v36.73,70.02 38.13,70.02 D14.1 | v31.09,70.05 31.01,70.02 31.01,70.15 R51.2 30.76,70.15 27.08,70.15 C56.2 27.08,70.4 26.82,70.65 26.82,76.27 | 34.95,84.12 36.6,85.77 36.6,86.15 R12.1 36.73,86.4 38.13,87.8 38.13,87.93 | 34.95,84.12 32.03,81.2 C25.2 32.03,80.94 32.03,79.67 28.98,76.62 C27.1 | 38.13,87.93 38.13,88.94 40.16,90.97 40.37,91.17 | 44.09,90.97 42.44,89.32 42.44,88.18 42.19,87.93 38.13,87.93 | 44.09,90.97 44.31,91.19 | v11.96,73.45 11.96,68.37 16.03,68.37 C24.1 | C21.2 32.41,113.96 30.76,112.31 30.76,107.1 30.63,106.98 R21.1 30.76,106.72 32.16,105.33 32.16,100.25 R10.1 31.9,100.25 33.43,98.72 33.43,96.44 32.79,95.8 | 32.79,95.8 32.03,95.04 C5.2 | 6.25,79.16 LEM.4 | 6.63,95.55 HF-CT.1 6.63,95.93 | 34.95,84.12 32.92,86.15 32.92,95.67 32.79,95.8 | OC_RST.2 111.28,140.63 111.28,141.77 104.55,141.77 C49.2 104.29,142.03 104.29,143.3 100.74,143.3 | 91.35,136.95 100.36,136.95 100.36,142.92 100.74,143.3 | v100.61,145.2 100.61,143.43 100.74,143.3 | R25.1 63.02,117.39 63.27,117.64 63.27,125.52 63.4,125.65 D11.A 63.4,125.9 63.4,130.6 | 63.4,130.6 63.4,130.85 63.02,131.23 62.91,131.53 | v68.61,144.19 66.95,145.84 R69.2 | v70.64,143.93 70.64,137.58 71.78,136.44 IC13.1
  Top 0.508: 76.1,133.27 76.1,133.65 75.84,133.9 75.75,134.17 | 76.1,133.27 76.1,119.68 | 76.1,119.68 76.1,118.15 C42.2 75.97,117.9 75.46,117.39 75.46,111.8 v74.83,110.26 | 76.1,133.27 72.92,133.27 72.03,134.15 71.86,134.38 | 63.4,130.6 64.92,130.6 64.92,140 64.54,140.38 v64.54,143.93 64.67,144.06 64.67,150.92 95.66,150.92 96.42,150.16 96.42,147.49 98.07,145.84 GNDA.1 | v50.57,105.83 50.57,103.8 R30.2 | v44.35,108.37 44.17,108.55 | v65.68,110.28 65.68,113.33 R43.1 | v59.21,112.18 59.21,110.66 IC4.7 | R3.1 8.03,106.21 12.98,106.21 13.16,106.29 | 17.81,109.77 13.36,109.77 13.36,108.25 IC6.1 | 17.81,109.77 20.22,109.77 D10.C | 8.28,197.27 7915.GND | C22.2 47.78,114.72 46.61,115.89 46.51,115.99 46.38,115.87 v46.38,110.28 | v50.06,136.31 50.06,135.81 51.59,135.81 C38.1 | 16.54,124.15 16.54,117.26 R18.2 16.54,117.01 17.81,115.74 17.81,109.77 | C14.+ 27.97,153.2 27.97,153.33 | 33.24,153.43 33.3,153.46 33.3,153.33 | 37.34,153.36 37.36,153.33 37.18,153.15 | v76.23,119.68 76.1,119.68 | 44.09,90.97 44.26,91.23
  Top 0.559: IC8.5 26.82,76.27 28.36,76.27 C27.1
  Top 0.61: IC5.1 40.45,91.25 40.37,91.17 | IC5.4 44.26,91.23 | C11.1 95.94,56.82 R40.2 | C55.2 91.35,136.95 91.35,137.9 D12.1 | IC7.7 62.9,131.54 62.91,131.53 | IC13.4 75.69,134.24 75.75,134.17 | IC13.1 71.88,134.4 71.86,134.38 | IC2.7 44.16,108.56 44.17,108.55 | IC6.1 13.23,106.37 13.16,106.29
  Top 0.813: 45.73,132.61 45.73,125.23 46.88,124.08 46.88,116.16 46.61,115.89
  Top 1.27: R65.1 22.94,98.47 23.55,97.87 23.55,96.37 25.18,94.74 C15.1 31.39,94.74 C5.2
  Top 1.676: 27.64,153.15 27.83,153.33 27.97,153.33 33.3,153.33 37,153.33 37.18,153.15 38.92,151.42 C16.- 39.07,150.18 39.07,143.35 39.74,142.67 44.98,142.67 45.39,142.26 45.39,142.21 46.79,140.81 46.79,133.66 45.73,132.61 39.62,132.61 38.63,133.6 C13.- 38.54,136.04 32.23,136.04 30.74,134.56 30.74,125.8 29.09,124.15 16.54,124.15 7.49,124.15 6.55,125.08 | 7815.GND 16.2,160.43 | 16.2,160.43 26.63,160.43 27.61,159.45 27.61,153.41 C14.+ | C18.2 16.31,160.14 16.2,160.24 16.2,160.43 | 15-0-15.2 6.54,134.75 6.02,134.23 6.02,125.62 6.55,125.08 | C17.+ 44.02,156.59 43.56,156.14 39.23,156.14 37.67,154.58 37.67,153.69 37.34,153.36 37,153.02 | C28.2 12.3,197.64 11.89,197.22 8.32,197.22 8.28,197.27 8.27,197.28 | 6.63,95.93 5.81,95.93 4.84,96.9 4.84,97 4.47,97.37 4.47,122.99 6.55,125.08 | 6.63,95.55 4.27,95.55 3.56,94.84 3.56,85.9 4.97,84.48 5.51,84.48 6.78,83.21 6.78,79.78 6.36,79.36 6.36,79.17 6.27,79.07 6.28,79.07 LEM.4
  Top 1.93: 0E2.2 33.23,153.44 33.24,153.43
  Bottom 0.508: v93.62,56.81 v79.4,56.81 | v87.66,96.18 91.97,96.18 v92.23,96.44 97.05,96.44 v98.83,94.66 | v97.31,72.05 99.47,74.21 v99.47,78.78 | v31.09,70.05 v36.73,70.02 | v11.96,73.45 6.38,79.04 LEM.4 | R65.1 20.6,98.59 20.41,98.29 | v100.61,145.2 98.7,145.2 98.2,145.71 GNDA.1 | v70.64,143.93 68.86,143.93 v68.61,144.19 68.48,144.06 64.67,144.06 v64.54,143.93 | v44.35,108.37 46.38,108.37 | 46.38,108.37 48.03,108.37 v50.57,105.83 54.51,109.77 59.21,109.77 | 59.21,109.77 65.18,109.77 v65.68,110.28 v74.83,110.26 | 59.21,109.77 v59.21,112.18 | 3.7,196.14 3.71,196.13 3.64,196.06 | v50.06,136.31 50.06,142.16 48.92,142.16 47.9,143.17 45.75,143.17 38.76,136.19 C13.- 38.63,136.06 | v46.38,110.28 46.38,108.37 | v76.23,119.68 79.78,119.68 | v83.57,118.37 83.59,118.41 83.46,118.5
  Bottom 0.559: 79.78,119.68 83.14,119.68 83.46,119.36 83.46,118.5 83.56,118.4
  Bottom 1.676: 7915.GND 4.15,197.35 3.72,196.92 3.72,196.15 3.7,196.14 3.68,196.12 | 3.64,196.06 3.64,160.6 5.61,160.39 5.64,160.43 7815.GND | HF-CT.1 19.75,95.66 20.41,96.32 20.41,98.29 20.5,98.39
GNDINT  (via drill 0.38, 0.46)
  Top 0.406: AD8495.3 31.34,18.59 31.19,18.43 30.72,18.43 30.69,18.47 | AD8495.2 30.69,18.47 | 30.69,18.47 30.64,18.41 34.98,18.41 | 34.98,18.41 R82.1 | 34.98,18.41 34.98,22.04 C54.1